# Altium schematic sheet CoffeeMaker.Top.SchDoc
size A
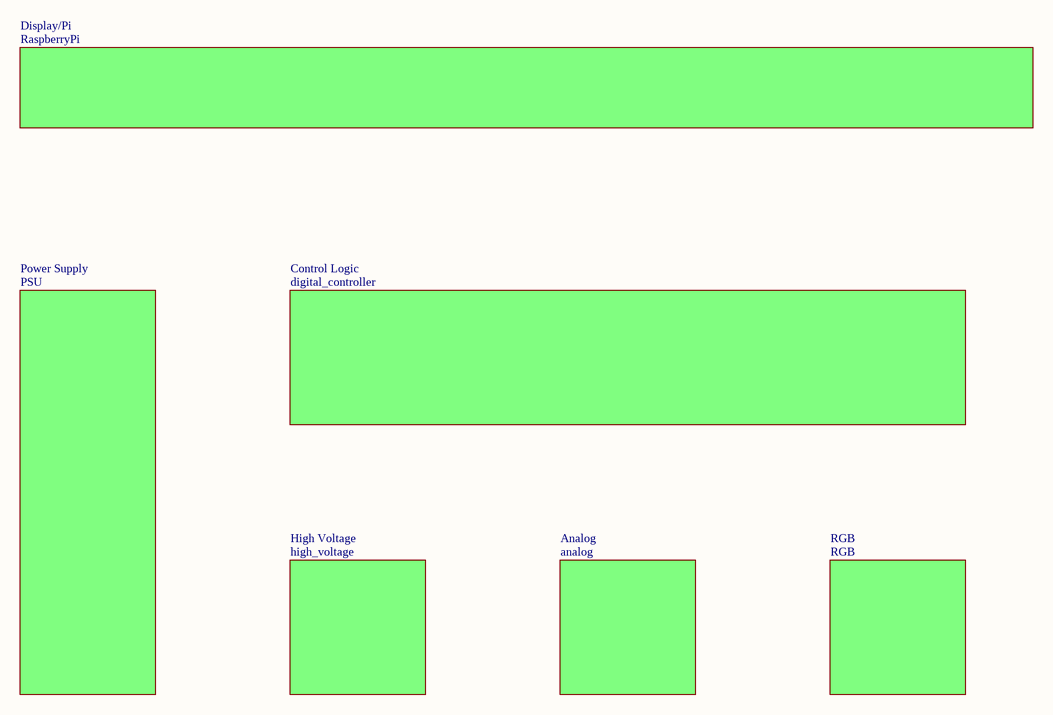
[diagram p0: CoffeeMaker.Top.SchDoc]

## Sub-sheets
Analog = analog: no entries
Control Logic = digital_controller: no entries
Display/Pi = RaspberryPi: no entries
High Voltage = high_voltage: no entries
Power Supply = PSU: no entries
RGB = RGB: no entries